# EAGLE design IE ARSA Merah W (EAGLE 8.5.1)
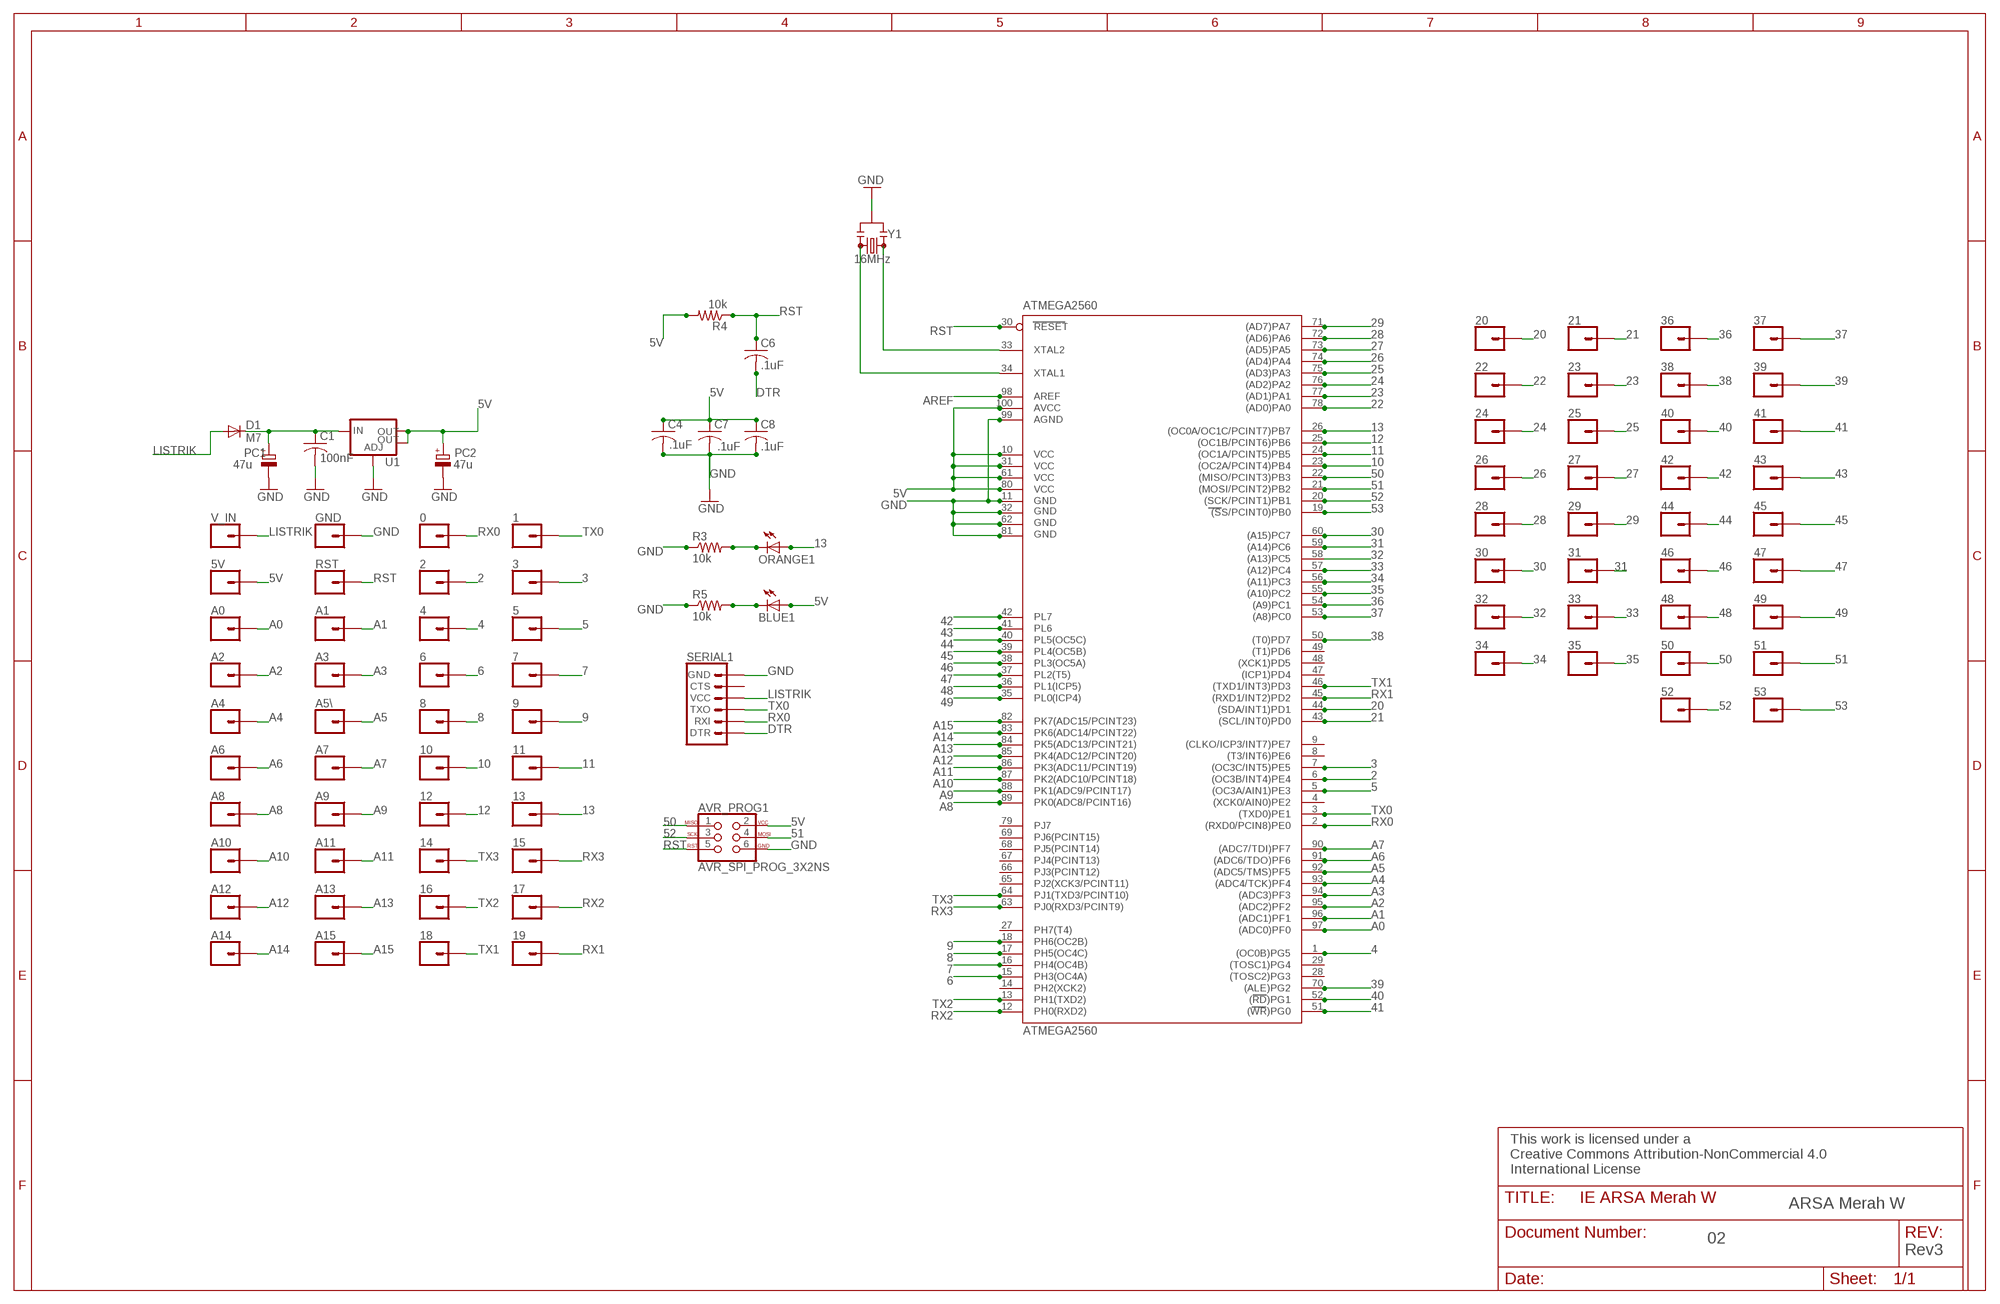
[diagram p0: schematic, sheet 1]

## Parts
0  CONN_01  [1X01]
1  CONN_01  [1X01]
2  CONN_01  [1X01]
3  CONN_01  [1X01]
4  CONN_01  [1X01]
5  CONN_01  [1X01]
5V  CONN_01  [1X01]
6  CONN_01  [1X01]
7  CONN_01  [1X01]
8  CONN_01  [1X01]
9  CONN_01  [1X01]
10  CONN_01  [1X01]
11  CONN_01  [1X01]
12  CONN_01  [1X01]
13  CONN_01  [1X01]
14  CONN_01  [1X01]
15  CONN_01  [1X01]
16  CONN_01  [1X01]
17  CONN_01  [1X01]
18  CONN_01  [1X01]
19  CONN_01  [1X01]
20  CONN_01  [1X01]
21  CONN_01  [1X01]
22  CONN_01  [1X01]
23  CONN_01  [1X01]
24  CONN_01  [1X01]
25  CONN_01  [1X01]
26  CONN_01  [1X01]
27  CONN_01  [1X01]
28  CONN_01  [1X01]
29  CONN_01  [1X01]
30  CONN_01  [1X01]
31  CONN_01  [1X01]
32  CONN_01  [1X01]
33  CONN_01  [1X01]
34  CONN_01  [1X01]
35  CONN_01  [1X01]
36  CONN_01  [1X01]
37  CONN_01  [1X01]
38  CONN_01  [1X01]
39  CONN_01  [1X01]
40  CONN_01  [1X01]
41  CONN_01  [1X01]
42  CONN_01  [1X01]
43  CONN_01  [1X01]
44  CONN_01  [1X01]
45  CONN_01  [1X01]
46  CONN_01  [1X01]
47  CONN_01  [1X01]
48  CONN_01  [1X01]
49  CONN_01  [1X01]
50  CONN_01  [1X01]
51  CONN_01  [1X01]
52  CONN_01  [1X01]
53  CONN_01  [1X01]
A0  CONN_01  [1X01]
A1  CONN_01  [1X01]
A2  CONN_01  [1X01]
A3  CONN_01  [1X01]
A4  CONN_01  [1X01]
A5\  CONN_01  [1X01]
A6  CONN_01  [1X01]
A7  CONN_01  [1X01]
A8  CONN_01  [1X01]
A9  CONN_01  [1X01]
A10  CONN_01  [1X01]
A11  CONN_01  [1X01]
A12  CONN_01  [1X01]
A13  CONN_01  [1X01]
A14  CONN_01  [1X01]
A15  CONN_01  [1X01]
ATMEGA2560  ATMEGA2560  [TQFP100]
AVR_PROG1  AVR_SPI_PROG_3X2NS  [2X3-NS]
BLUE1  L  LED-SMD-0805  [SMD-0805-LED]
C1  100nF  CAPACITOR-SMD-0805  [SMD-0805]
C4  CAPACITOR-SMD-0805  [SMD-0805]
C6  .1uF  CAPACITOR-SMD-0805  [SMD-0805]
C7  .1uF  CAPACITOR-SMD-0805  [SMD-0805]
C8  .1uF  CAPACITOR-SMD-0805  [SMD-0805]
D1  M7  DIODE-SMB  [SMB]
GND  CONN_01  [1X01]
ORANGE1  L  LED-SMD-0805  [SMD-0805-LED]
PC1  47u  CPOL-EUD  [PANASONIC_D]
PC2  47u  CPOL-EUD  [PANASONIC_D]
R3  10k  RESISTOR-SMD-0805  [SMD-0805]
R4  10k  RESISTOR-SMD-0805  [SMD-0805]
R5  10k  RESISTOR-SMD-0805  [SMD-0805]
RST  CONN_01  [1X01]
SERIAL1  6_PIN_SERIAL_TARGET  [1X06]
U1  V_REG_LM1117SOT223  [SOT223]
V_IN  CONN_01  [1X01]
Y1  16MHz  RESONATOR-16MHZSMD_3.2X1.3  [RESONATOR-SMD-3.2X1.3]

## Nets
2: 2.1 ATMEGA2560.6((OC3B/INT4)PE4)
3: 3.1 ATMEGA2560.7((OC3C/INT5)PE5)
4: 4.1 ATMEGA2560.1((OC0B)PG5)
5: 5.1 ATMEGA2560.5((OC3A/AIN1)PE3)
5V: 5V.1 ATMEGA2560.10(VCC) ATMEGA2560.31(VCC1) ATMEGA2560.61(VCC2) ATMEGA2560.80(VCC3) ATMEGA2560.100(AVCC) AVR_PROG1.2 BLUE1.1(A) C4.1 C7.1 C8.1 PC2.+ R4.2 U1.2(OUT) U1.4(OUT)
6: 6.1 ATMEGA2560.15(PH3(OC4A))
7: 7.1 ATMEGA2560.16(PH4(OC4B))
8: 8.1 ATMEGA2560.17(PH5(OC4C))
9: 9.1 ATMEGA2560.18(PH6(OC2B))
10: 10.1 ATMEGA2560.23((OC2A/PCINT4)PB4)
11: 11.1 ATMEGA2560.24((OC1A/PCINT5)PB5)
12: 12.1 ATMEGA2560.25((OC1B/PCINT6)PB6)
13: 13.1 ATMEGA2560.26((OC0A/OC1C/PCINT7)PB7) ORANGE1.1(A)
20: 20.1 ATMEGA2560.44((SDA/INT1)PD1)
21: 21.1 ATMEGA2560.43((SCL/INT0)PD0)
22: 22.1 ATMEGA2560.78((AD0)PA0)
23: 23.1 ATMEGA2560.77((AD1)PA1)
24: 24.1 ATMEGA2560.76((AD2)PA2)
25: 25.1 ATMEGA2560.75((AD3)PA3)
26: 26.1 ATMEGA2560.74((AD4)PA4)
27: 27.1 ATMEGA2560.73((AD5)PA5)
28: 28.1 ATMEGA2560.72((AD6)PA6)
29: 29.1 ATMEGA2560.71((AD7)PA7)
30: 30.1 ATMEGA2560.60((A15)PC7)
31: 31.1 ATMEGA2560.59((A14)PC6)
32: 32.1 ATMEGA2560.58((A13)PC5)
33: 33.1 ATMEGA2560.57((A12)PC4)
34: 34.1 ATMEGA2560.56((A11)PC3)
35: 35.1 ATMEGA2560.55((A10)PC2)
36: 36.1 ATMEGA2560.54((A9)PC1)
37: 37.1 ATMEGA2560.53((A8)PC0)
38: 38.1 ATMEGA2560.50((T0)PD7)
39: 39.1 ATMEGA2560.70((ALE)PG2)
40: 40.1 ATMEGA2560.52((RD)PG1)
41: 41.1 ATMEGA2560.51((WR)PG0)
42: 42.1 ATMEGA2560.42(PL7)
43: 43.1 ATMEGA2560.41(PL6)
44: 44.1 ATMEGA2560.40(PL5(OC5C))
45: 45.1 ATMEGA2560.39(PL4(OC5B))
46: 46.1 ATMEGA2560.38(PL3(OC5A))
47: 47.1 ATMEGA2560.37(PL2(T5))
48: 48.1 ATMEGA2560.36(PL1(ICP5))
49: 49.1 ATMEGA2560.35(PL0(ICP4))
50: 50.1 ATMEGA2560.22((MISO/PCINT3)PB3) AVR_PROG1.1
51: 51.1 ATMEGA2560.21((MOSI/PCINT2)PB2) AVR_PROG1.4
52: 52.1 ATMEGA2560.20((SCK/PCINT1)PB1) AVR_PROG1.3
53: 53.1 ATMEGA2560.19((SS/PCINT0)PB0)
A0: A0.1 ATMEGA2560.97((ADC0)PF0)
A1: A1.1 ATMEGA2560.96((ADC1)PF1)
A2: A2.1 ATMEGA2560.95((ADC2)PF2)
A3: A3.1 ATMEGA2560.94((ADC3)PF3)
A4: A4.1 ATMEGA2560.93((ADC4/TCK)PF4)
A5: A5\.1 ATMEGA2560.92((ADC5/TMS)PF5)
A6: A6.1 ATMEGA2560.91((ADC6/TDO)PF6)
A7: A7.1 ATMEGA2560.90((ADC7/TDI)PF7)
A8: A8.1 ATMEGA2560.89(PK0(ADC8/PCINT16))
A9: A9.1 ATMEGA2560.88(PK1(ADC9/PCINT17))
A10: A10.1 ATMEGA2560.87(PK2(ADC10/PCINT18))
A11: A11.1 ATMEGA2560.86(PK3(ADC11/PCINT19))
A12: A12.1 ATMEGA2560.85(PK4(ADC12/PCINT20))
A13: A13.1 ATMEGA2560.84(PK5(ADC13/PCINT21))
A14: A14.1 ATMEGA2560.83(PK6(ADC14/PCINT22))
A15: A15.1 ATMEGA2560.82(PK7(ADC15/PCINT23))
AREF: ATMEGA2560.98(AREF)
DTR: C6.2 SERIAL1.1(DTR)
GND: ATMEGA2560.11(GND) ATMEGA2560.32(GND1) ATMEGA2560.62(GND2) ATMEGA2560.81(GND3) ATMEGA2560.99(AGND) AVR_PROG1.6 C1.2 C4.2 C7.2 C8.2 GND.1 PC1.- PC2.- R3.1 R5.1 SERIAL1.6(GND) U1.1(ADJ) Y1.2
LISTRIK: D1.A SERIAL1.4(VCC) V_IN.1
N$1: ORANGE1.2(C) R3.2
N$2: ATMEGA2560.33(XTAL2) Y1.1
N$3: BLUE1.2(C) R5.2
N$4: ATMEGA2560.34(XTAL1) Y1.3
RST: ATMEGA2560.30(RESET) AVR_PROG1.5 C6.1 R4.1 RST.1
RX0: 0.1 ATMEGA2560.2((RXD0/PCIN8)PE0) SERIAL1.2(RXI)
RX1: 19.1 ATMEGA2560.45((RXD1/INT2)PD2)
RX2: 17.1 ATMEGA2560.12(PH0(RXD2))
RX3: 15.1 ATMEGA2560.63(PJ0(RXD3/PCINT9))
TX0: 1.1 ATMEGA2560.3((TXD0)PE1) SERIAL1.3(TXO)
TX1: 18.1 ATMEGA2560.46((TXD1/INT3)PD3)
TX2: 16.1 ATMEGA2560.13(PH1(TXD2))
TX3: 14.1 ATMEGA2560.64(PJ1(TXD3/PCINT10))
VIN: C1.1 D1.C PC1.+ U1.3(IN)
Unconnected: ATMEGA2560.4((XCK0/AIN0)PE2) ATMEGA2560.8((T3/INT6)PE6) ATMEGA2560.9((CLKO/ICP3/INT7)PE7) ATMEGA2560.14(PH2(XCK2)) ATMEGA2560.27(PH7(T4)) ATMEGA2560.28((TOSC2)PG3) ATMEGA2560.29((TOSC1)PG4) ATMEGA2560.47((ICP1)PD4) ATMEGA2560.48((XCK1)PD5) ATMEGA2560.49((T1)PD6) ATMEGA2560.65(PJ2(XCK3/PCINT11)) ATMEGA2560.66(PJ3(PCINT12)) ATMEGA2560.67(PJ4(PCINT13)) ATMEGA2560.68(PJ5(PCINT14)) ATMEGA2560.69(PJ6(PCINT15)) ATMEGA2560.79(PJ7) SERIAL1.5(CTS)

## Notes on the sheet
- .1uF
- This work is licensed under a 
  Creative Commons Attribution-NonCommercial 4.0
  International License
- ARSA Merah W
- 02
- Rev3

## Library data of the parts
0 1-5 5V 6-53 A0 A1-A4 A5\ A6-A15 GND RST V_IN = SparkFun-Connectors:CONN_01: Single connection point. Often used as Generic Header-pin footprint for 0.1 inch spaced/style header connections On any of the 0.1 inch spaced packages, you can populate with these: Break Away Headers - Straight <https://www.sparkfun.com/products/116> (PRT-00116) Break Away Male Headers - Right Angle <https://www.sparkfun.com/products/553> (PRT-00553) Female Headers <https://www.sparkfun.com/products/115> (PRT-00115) Break Away Headers - Machine Pin <https://www.sparkfun.com/products/117> (PRT-00117) Break Away Female Headers - Swiss Machine Pin <https://www.sparkfun.com/products/743> (PRT-00743) This device is also useful as a general connection point to wire up your design to another part of your project. Our various solder wires solder well into these plated through hole pads. Hook-Up Wire - Assortment (Stranded, 22 AWG) <https://www.sparkfun.com/products/11375> (PRT-11375) Hook-Up Wire - Assortment (Solid Core, 22 AWG) <https://www.sparkfun.com/products/11367> (PRT-11367) View the entire wire category on our website here <https://www.sparkfun.com/categories/141> Special notes: SMTSO-256-ET is a "flush mount" nut for a 4-40 screw. We mostly use this on specialty testbeds; it is a nice way to connect hardware to your PCB at an adjustable hieght. Also note, the SNAP packages are for using a snappable style connector. We sell a baggie of snaps and they are also used on two LilyPad designs: Snap Assortment - 30 pack (male and female) <https://www.sparkfun.com/products/11347> (DEV-11347) LilyPad Arduino SimpleSnap <https://www.sparkfun.com/products/10941> (DEV-10941) LilyPad SimpleSnap Protoboard <https://www.sparkfun.com/products/10940> (DEV-10940)
ATMEGA2560 = Fuzzy:ATMEGA2560
AVR_PROG1 = SparkFun-Connectors:AVR_SPI_PROG_3X2: AVR ISP 6 Pin This is the reduced ISP connector for AVR programming. Common on Arduino. This footprint will take up less PCB space and can be used with a 10-pin to 6-pin adapter such as SKU: BOB-08508 **Special note about "TEST_POINT" package. The stop mask is on the top side, so if you want your programming test points to be on the bottom of your board, make sure to place this package on the bottom side of the board. This also ensure that the orientation to program from the bottom side will be correct. SparkFun Products: SparkFun ISP Pogo Adapter <https://www.sparkfun.com/products/11591> - NS Tiny AVR Programmer <https://www.sparkfun.com/products/11801> -PTH
BLUE1 ORANGE1 = Fuzzy:LED-SMD-0805
C1 C4 C6-C8 = Fuzzy:CAPACITOR-SMD-0805
D1 = diode:DIODE-: DIODE
PC1 PC2 = rcl:CPOL-EU: POLARIZED CAPACITOR, European symbol
R3-R5 = Fuzzy:RESISTOR-SMD-0805
SERIAL1 = SparkFun-Connectors:6_PIN_SERIAL_TARGET: 6-pin header connection for use with the "FTDI BASIC" pinout - TARGET SIDE. Also known as "Arduino Serial Program Header". It is used to mate with our FTDI Basic serial programmers using the Arduino IDE. Note, this device has "TARGET" in the name. It is intended to be used on a design that contains a target micro-controller that you wish to program. The "sister" device, named "CABLE" is inteneded to be used on a design that usually lives on the end of your USB cable and prvides the converter chip (FTDI232 or FTDI231x) to commnicate serial RX/TX. You can populate with some of these: Break Away Headers - Straight <https://www.sparkfun.com/products/116> (PRT-00116) For reference (or to suit your programming needs) check out these designs: SparkFun FTDI Basic Breakout - 5V <https://www.sparkfun.com/products/9716> (DEV-09716) SparkFun FTDI Basic Breakout - 3.3V <https://www.sparkfun.com/products/9873> (DEV-09873) SparkFun FTDI SmartBasic <https://www.sparkfun.com/products/12935> (DEV-12935) SparkFun Beefy 3 - FTDI Basic Breakout <https://www.sparkfun.com/products/13746> (DEV-13746)
U1 = SparkFun-IC-Power:V_REG_LM1117: Voltage Regulator LM1117 Standard adjustable voltage regulator but in SMD form. Spark Fun Electronics SKU : COM-00595; PROD_ID: VREG-08170
Y1 = SparkFun-Clocks:RESONATOR-16MHZ: 16MHz Resonator Digikey Example <http://www.digikey.com/product-detail/en/murata-electronics-north-america/CSTCE16M0V53-R0/490-1198-1-ND/584635> Frequency: 16MHz Frequency Stability: ±0.3% Frequency Tolerance: ±0.5% Capacitance: 15pF SparkFun Products SparkFun OpenLog <https://www.sparkfun.com/products/13712> SparkFun MicroView - OLED Arduino Module <https://www.sparkfun.com/products/12923>; PROD_ID: XTAL-08900

## Net classes
0 default: width 0.15 mm, drill 0.3 mm, clearance 0.15 mm

## Board
ARSA Merah W
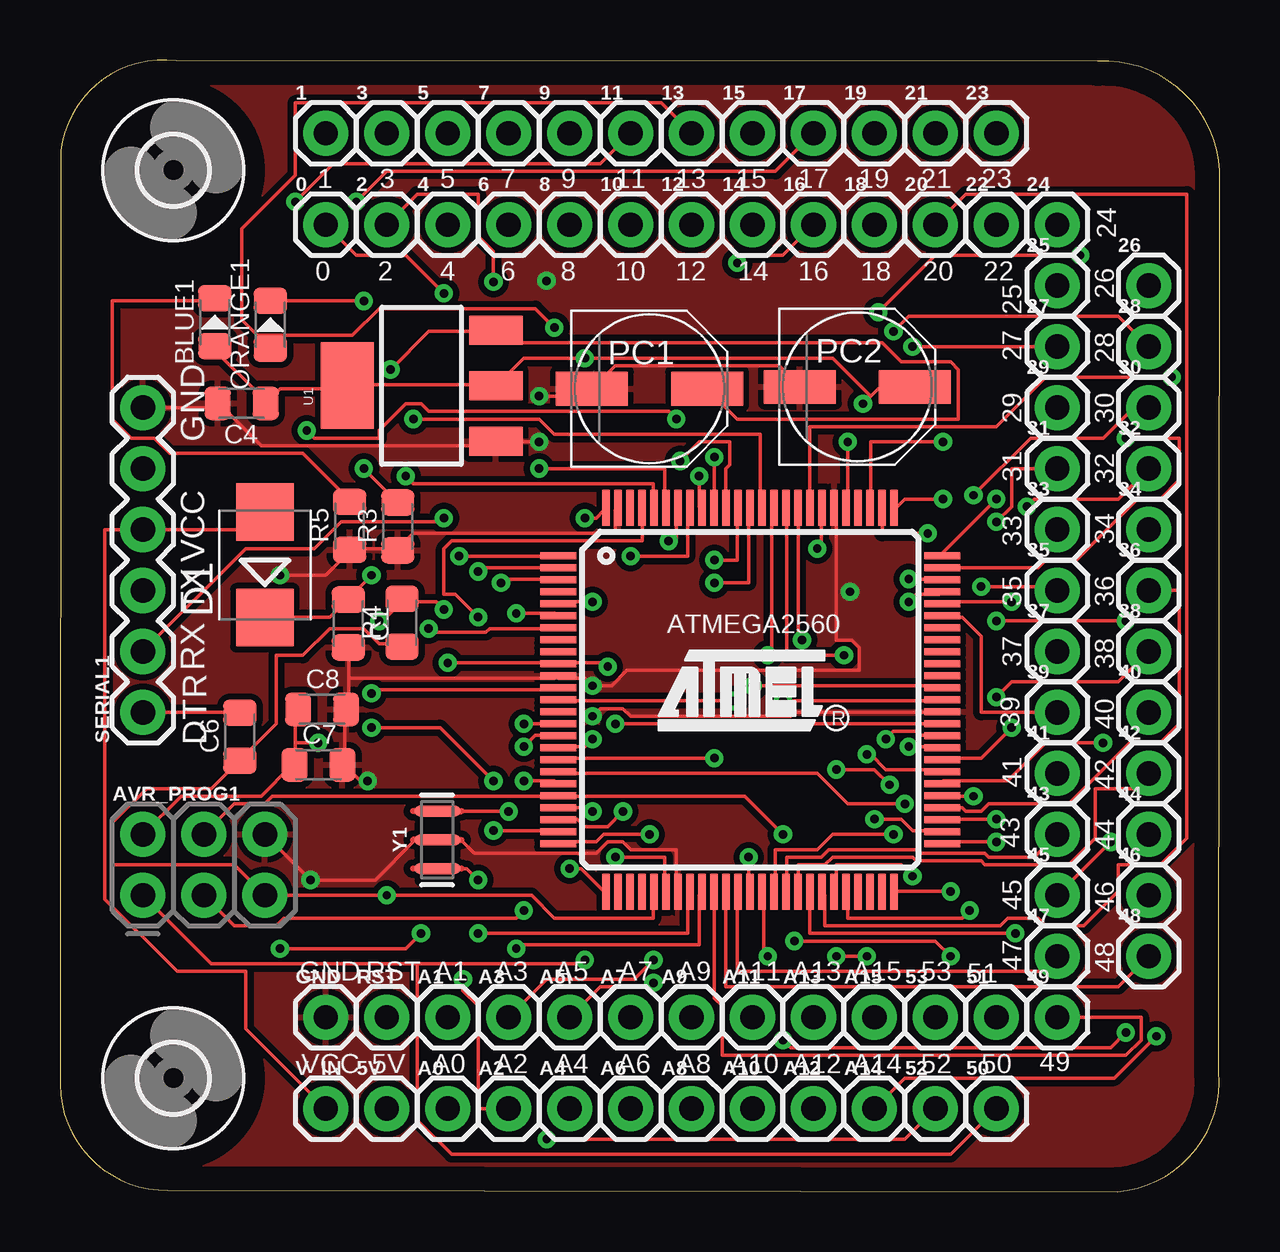
[diagram p1: board, top side]
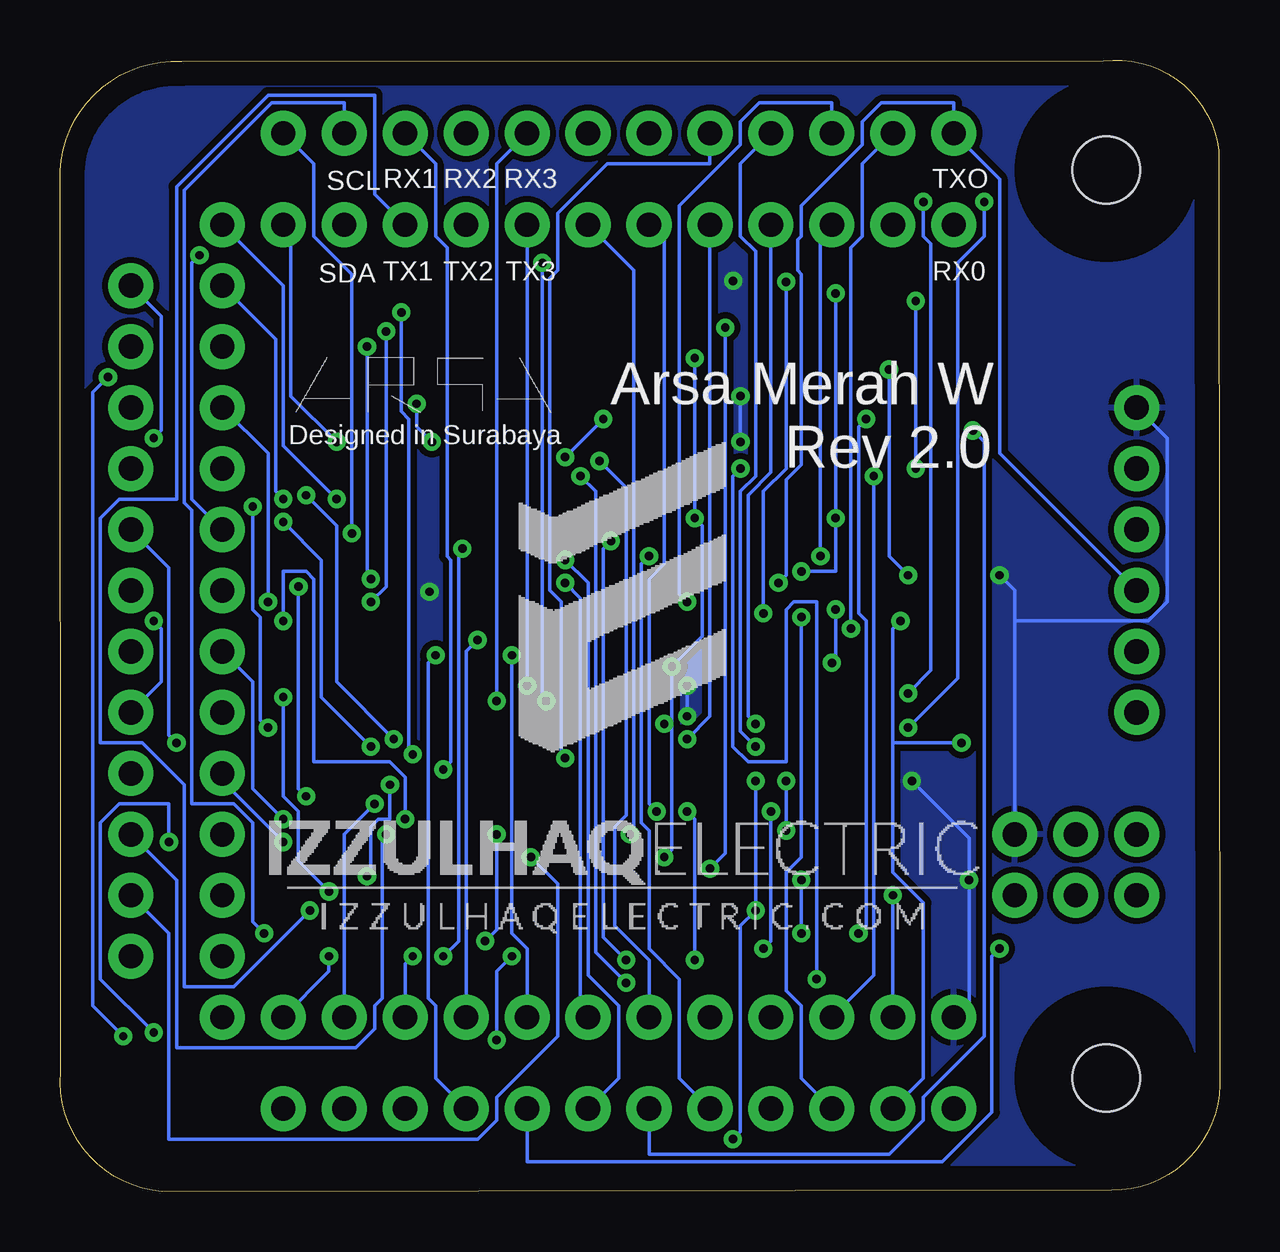
[diagram p2: board, bottom side, seen from below]

Size 48.32 x 47.15 mm. Coordinates in mm from the lower left corner, seen from the top.
Outline: 43.25,47.09 4.84,47.12 arc90 0.03,43.36 0,4.45 arc90 4.5,0.05 44.05,0 arc90 48.29,4.97 48.32,42.53 arc90 43.25,47.09
Copper layers ((1*16)): Top 0.04mm / dielectric 0.5mm / Bottom 0.04mm
Design rules "default *": minimum track width 6mil, minimum drill 0.35mm, track to track 6mil, track to pad 6mil, pad to pad 6mil, via to via 6mil, smd to smd 6mil, copper to edge 40mil, drill to drill 6mil, minimum pad ring 10mil, minimum via ring 8mil, stop-mask expansion 4mil, vias tented up to drill 0mil, thermal gap 10mil

### Footprints (pad centres in the part's own frame; a part is rotated, then mirrored left to right if it is on the bottom)
1X01 = drill 1.016 pad 1.88: 1 0,0
TQFP100 = smd 1.5 x 0.3: 1 -8,6; 2 -8,5.5; 3 -8,5; 4 -8,4.5; 5 -8,4; 6 -8,3.5; 7 -8,3; 8 -8,2.5; 9 -8,2; 10 -8,1.5; 11 -8,1; 12 -8,0.5; 13 -8,0; 14 -8,-0.5; 15 -8,-1; 16 -8,-1.5; 17 -8,-2; 18 -8,-2.5; 19 -8,-3; 20 -8,-3.5; 21 -8,-4; 22 -8,-4.5; 23 -8,-5; 24 -8,-5.5; 25 -8,-6; 51 8,-6; 52 8,-5.5; 53 8,-5; 54 8,-4.5; 55 8,-4; 56 8,-3.5; 57 8,-3; 58 8,-2.5; 59 8,-2; 60 8,-1.5; 61 8,-1; 62 8,-0.5; 63 8,0; 64 8,0.5; 65 8,1; 66 8,1.5; 67 8,2; 68 8,2.5; 69 8,3; 70 8,3.5; 71 8,4; 72 8,4.5; 73 8,5; 74 8,5.5; 75 8,6 | smd 0.3 x 1.5: 26 -6,-8; 27 -5.5,-8; 28 -5,-8; 29 -4.5,-8; 30 -4,-8; 31 -3.5,-8; 32 -3,-8; 33 -2.5,-8; 34 -2,-8; 35 -1.5,-8; 36 -1,-8; 37 -0.5,-8; 38 0,-8; 39 0.5,-8; 40 1,-8; 41 1.5,-8; 42 2,-8; 43 2.5,-8; 44 3,-8; 45 3.5,-8; 46 4,-8; 47 4.5,-8; 48 5,-8; 49 5.5,-8; 50 6,-8; 76 6,8; 77 5.5,8; 78 5,8; 79 4.5,8; 80 4,8; 81 3.5,8; 82 3,8; 83 2.5,8; 84 2,8; 85 1.5,8; 86 1,8; 87 0.5,8; 88 0,8; 89 -0.5,8; 90 -1,8; 91 -1.5,8; 92 -2,8; 93 -2.5,8; 94 -3,8; 95 -3.5,8; 96 -4,8; 97 -4.5,8; 98 -5,8; 99 -5.5,8; 100 -6,8
2X3-NS = drill 1.016 pad 1.88: 1 -2.54,-1.27; 2 -2.54,1.27; 3 0,-1.27; 4 0,1.27; 5 2.54,-1.27; 6 2.54,1.27
SMD-0805-LED = smd 1.1 x 1.4: 1 -1,0; 2 1,0
SMD-0805 = smd 1.1 x 1.4: 1 -1,0; 2 1,0
SMB = smd 2.4 x 2.4: A 2.2,0; C -2.2,0
PANASONIC_D = smd 3 x 1.4: + 2.4,0; - -2.4,0
1X06 = drill 1.016 pad 1.88: 1 0,0; 2 2.54,0; 3 5.08,0; 4 7.62,0; 5 10.16,0; 6 12.7,0
SOT223 = smd 1.219 x 2.235: 1 -2.311,-3.099; 2 0,-3.099; 3 2.311,-3.099 | smd 3.6 x 2.2: 4 0,3.099
2,8 = hole 2.8: 0,0
RESONATOR-SMD-3.2X1.3 = smd 0.45 x 1.905: 1 -1.2,0; 2 0,0; 3 1.2,0

### Placement (x,y rotation side)
0  11.07,40.28 0 top
1  11.07,44.09 0 top
2  13.61,40.28 0 top
3  13.61,44.09 0 top
4  16.15,40.28 0 top
5  16.15,44.09 0 top
5V  13.61,3.45 0 top
6  18.69,40.28 0 top
7  18.69,44.09 0 top
8  21.23,40.28 0 top
9  21.23,44.09 0 top
10  23.77,40.28 0 top
11  23.77,44.09 0 top
12  26.31,40.28 0 top
13  26.31,44.09 0 top
14  28.85,40.28 0 top
15  28.85,44.09 0 top
16  31.39,40.28 0 top
17  31.39,44.09 0 top
18  33.93,40.28 0 top
19  33.93,44.09 0 top
20  36.47,40.28 0 top
21  36.47,44.09 0 top
22  39.01,40.28 0 top
23  39.01,44.09 0 top
24  41.55,40.28 0 top
25  41.55,37.74 0 top
26  45.36,37.74 0 top
27  41.55,35.2 0 top
28  45.36,35.2 0 top
29  41.55,32.66 0 top
30  45.36,32.66 0 top
31  41.55,30.12 0 top
32  45.36,30.12 0 top
33  41.55,27.58 0 top
34  45.36,27.58 0 top
35  41.55,25.04 0 top
36  45.36,25.04 0 top
37  41.55,22.5 0 top
38  45.36,22.5 0 top
39  41.55,19.96 0 top
40  45.36,19.96 0 top
41  41.55,17.42 0 top
42  45.36,17.42 0 top
43  41.55,14.88 0 top
44  45.36,14.88 0 top
45  41.55,12.34 0 top
46  45.36,12.34 0 top
47  41.55,9.8 0 top
48  45.36,9.8 0 top
49  41.55,7.26 0 top
50  39.01,3.45 0 top
51  39.01,7.26 0 top
52  36.47,3.45 0 top
53  36.47,7.26 0 top
A0  16.15,3.45 0 top
A1  16.15,7.26 0 top
A2  18.69,3.45 0 top
A3  18.69,7.26 0 top
A4  21.23,3.45 0 top
A5\  21.23,7.26 0 top
A6  23.77,3.45 0 top
A7  23.77,7.26 0 top
A8  26.31,3.45 0 top
A9  26.31,7.26 0 top
A10  28.85,3.45 0 top
A11  28.85,7.26 0 top
A12  31.39,3.45 0 top
A13  31.39,7.26 0 top
A14  33.93,3.45 0 top
A15  33.93,7.26 0 top
ATMEGA2560  28.75,20.5 0 top
AVR_PROG1  5.99,13.61 0 top
BLUE1  6.45,36.22 90 top
C1  12.01,23.67 270 top
C4  7.57,32.84 180 top
C6  7.49,18.95 90 top
C7  10.77,17.78 0 top
C8  10.92,20.09 0 top
D1  8.53,26.11 90 top
GND  11.07,7.26 0 top
ORANGE1  8.76,36.12 90 top
PC1  24.56,33.45 0 top
PC2  33.22,33.53 0 top
R3  14.07,27.71 90 top
R4  14.25,23.7 90 top
R5  12.07,27.74 90 top
RST  13.61,7.26 0 top
SERIAL1  3.45,19.96 90 top
U1  15.06,33.58 90 top
U$1  [2,8]  4.72,42.56 0 top
U$2  [2,8]  4.72,4.72 0 top
V_IN  11.07,3.45 0 top
Y1  15.72,14.66 90 top

### Tracks (layer width: path | path; a pad name or v marks a point on that pad's centre or on a via)
2  (via drill 0.35)
  Top 0.152: v19.01,24.09 20.6,24.09 ATMEGA2560.6 | v18.06,37.9 18.06,39.17 17.42,39.81 17.42,41.55 14.88,41.55 2.1
  Bottom 0.152: v19.01,24.09 19.01,29.17 18.06,30.12 v18.06,37.9
3  (via drill 0.35)
  Top 0.152: v15.36,23.46 15.52,23.3 17.74,23.3 17.9,23.46 20.6,23.46 ATMEGA2560.7
  Bottom 0.152: v15.36,23.46 15.36,39.33 14.88,39.81 14.88,42.82 3.1
4  (via drill 0.35)
  Top 0.152: v16.63,26.47 20.6,26.47 ATMEGA2560.1
  Bottom 0.152: v16.63,26.47 16.63,39.81 4.1
5  (via drill 0.35)
  Top 0.152: v22.19,24.57 20.76,24.57 ATMEGA2560.5
  Bottom 0.152: v22.19,24.57 22.5,24.89 22.5,41.08 19.96,43.62 19.96,44.57 19.17,45.36 16.15,45.36 5.1
5V  (via drill 0.35)
  Top 0.152: v32.82,31.24 32.82,28.54 ATMEGA2560.80 | 33.78,33.14 34.09,33.46 35.52,33.46 PC2.+ | 33.78,33.14 v33.46,32.82 | BLUE1.1 6.31,35.2 8.53,32.98 C4.1 8.69,32.98 9.17,33.46 11.87,33.46 U1.4 12.03,33.62 18.06,33.62 U1.2 18.22,33.62 19.33,34.73 v21.87,34.73 32.19,34.73 33.78,33.14 | 9.8,18.69 9.8,19.96 C8.1 | 9.8,18.69 9.8,17.9 C7.1 9.65,17.74 8.38,16.47 5.04,16.47 AVR_PROG1.2 | 14.25,24.57 13.46,23.77 v13.3,23.77 | v16.15,22.03 20.6,22.03 ATMEGA2560.10 20.76,22.03 22.66,22.03 v22.82,21.87 | v16,24.25 15.68,24.57 14.25,24.57 | 14.25,24.57 R4.2 | v23.14,13.93 25.2,13.93 25.2,12.5 ATMEGA2560.31 | v23.14,19.49 36.63,19.49 ATMEGA2560.61 | v21.87,28.06 22.35,28.06 22.66,28.38 ATMEGA2560.100 | v10.76,18.69 9.8,18.69
  Bottom 0.152: v32.82,31.24 33.46,31.87 v33.46,32.82 | v13.3,23.77 13.61,23.46 13.61,18.69 | 13.61,18.69 13.61,13.3 12.34,12.03 12.34,4.72 5V.1 | v16.15,22.03 16,22.19 v16,24.25 | v23.14,13.93 22.82,14.25 22.82,19.49 | 22.82,19.49 v22.82,21.87 21.55,23.14 21.55,27.74 v21.87,28.06 v21.87,34.73 | 22.82,19.49 v23.14,19.49 | 13.61,18.69 v10.76,18.69
6  (via drill 0.35)
  Top 0.152: v19.33,19.49 20.6,19.49 ATMEGA2560.15
  Bottom 0.152: v19.33,19.49 19.65,19.81 19.65,29.01 18.69,29.97 6.1
7  (via drill 0.35)
  Top 0.152: v19.33,18.54 19.81,19.01 20.6,19.01 ATMEGA2560.16
  Bottom 0.152: v19.33,18.54 19.96,19.17 19.96,29.17 19.33,29.81 19.33,39.17 19.96,39.81 19.96,42.82 7.1
8  (via drill 0.35)
  Top 0.152: v22.19,18.85 21.87,18.54 20.76,18.54 ATMEGA2560.17
  Bottom 0.152: v22.19,18.85 21.23,19.81 8.1
9  (via drill 0.35)
  Top 0.152: v27.27,18.06 20.76,18.06 ATMEGA2560.18
  Bottom 0.152: v27.27,18.06 27.43,18.22 27.43,24.57 27.9,25.04 27.9,38.06 27.58,38.38 27.58,40.76 25.52,42.82 21.23,42.82 9.1
10  (via drill 0.35)
  Top 0.152: v23.46,15.84 22.82,15.2 21.87,15.2 21.55,15.52 20.76,15.52 ATMEGA2560.23
  Bottom 0.152: v23.46,15.84 23.77,16.15 23.77,25.52 23.14,26.16 23.14,39.65 10.1
11  (via drill 0.35)
  Top 0.152: v18.06,15.04 20.6,15.04 ATMEGA2560.24 | v18.06,17.11 15.84,19.33 v12.98,19.33 | v9.8,41.24 11.39,42.82 22.5,42.82 11.1
  Bottom 0.152: v18.06,17.11 v18.06,15.04 | v12.98,19.33 10.92,21.39 10.92,38.7 9.8,39.81 v9.8,41.24
12  (via drill 0.35)
  Top 0.152: v24.57,14.88 22.66,14.88 22.35,14.57 20.76,14.57 ATMEGA2560.25
  Bottom 0.152: v24.57,14.88 24.41,15.04 24.41,38.38 12.1
13  (via drill 0.35)
  Top 0.152: 8.22,35.68 7.58,36.32 7.58,40.13 9.8,42.35 9.8,45.36 25.04,45.36 13.1 | 8.22,35.68 8.69,35.2 ORANGE1.1 | v21.23,13.46 21.71,13.46 22.66,12.5 ATMEGA2560.26 | v20.6,36 19.81,36.79 13.3,36.79 12.19,35.68 8.22,35.68
  Bottom 0.152: v21.23,13.46 20.6,14.09 v20.6,36
20
  Top 0.152: 20.1 37.74,41.55 46.95,41.55 46.95,14.73 45.84,13.61 44.09,13.61 44.09,12.5 42.67,11.07 41.08,11.07 40.76,11.39 39.49,11.39 39.17,11.07 31.87,11.07 31.87,12.34 ATMEGA2560.44
21  (via drill 0.35)
  Top 0.152: v39.81,10.76 31.24,10.76 31.24,12.34 ATMEGA2560.43
  Bottom 0.152: v39.81,10.76 40.28,11.23 40.28,15.36 41.08,16.15 42.82,16.15 42.82,28.38 43.14,28.7 43.14,41.71 39.49,45.36 36.47,45.36 21.1
22  (via drill 0.35)
  Top 0.152: v36.79,31.24 33.78,31.24 33.78,28.54 ATMEGA2560.78
  Bottom 0.152: v36.79,31.24 38.7,33.14 38.7,39.97 22.1
23  (via drill 0.35)
  Top 0.152: v36.16,27.43 34.25,27.43 34.25,28.38 ATMEGA2560.77
  Bottom 0.152: v36.16,27.43 36.16,38.22 37.74,39.81 37.74,42.82 23.1
24  (via drill 0.35)
  Top 0.152: v36.79,28.85 35.2,28.85 34.89,28.54 ATMEGA2560.76
  Bottom 0.152: v36.79,28.85 39.01,31.08 39.01,37.74 24.1
25  (via drill 0.35)
  Top 0.152: v39.01,28.85 36.79,26.63 ATMEGA2560.75
  Bottom 0.152: v39.01,28.85 39.33,29.17 39.33,35.52 25.1
26  (via drill 0.35)
  Top 0.152: v44.41,31.39 46.63,31.39 46.63,29.65 45.84,28.85 44.89,28.85 42.35,26.31 41.08,26.31 40.76,26 36.79,26 ATMEGA2560.74
  Bottom 0.152: v44.41,31.39 44.09,31.71 44.09,36.47 26.1
27  (via drill 0.35)
  Top 0.152: v35.36,25.52 36.63,25.52 ATMEGA2560.73 | 27.1 v35.52,35.2
  Bottom 0.152: v35.36,25.52 35.52,25.68 v35.52,35.2
28  (via drill 0.35)
  Top 0.152: v35.36,24.57 35.68,24.89 36.63,24.89 ATMEGA2560.72 | v34.73,35.84 35.36,36.47 44.09,36.47 28.1
  Bottom 0.152: v35.36,24.57 34.73,25.2 v34.73,35.84
29  (via drill 0.35)
  Top 0.152: v39.65,24.57 36.79,24.57 ATMEGA2560.71
  Bottom 0.152: v39.65,24.57 39.65,30.76 29.1
30  (via drill 0.35)
  Top 0.152: v34.41,18.85 34.73,19.17 35.68,19.17 35.84,19.01 36.63,19.01 ATMEGA2560.60 | v38.06,29.01 40.44,31.39 43.46,31.39 44.73,32.66 30.1
  Bottom 0.152: v34.41,18.85 36.79,21.23 36.79,27.74 v38.06,29.01
31  (via drill 0.35)
  Top 0.152: v35.36,18.54 36.63,18.54 ATMEGA2560.59 | v39.01,27.9 39.65,28.54 39.65,30.12 31.1
  Bottom 0.152: v35.36,18.54 37.43,20.6 37.43,26.31 v39.01,27.9
32  (via drill 0.35)
  Top 0.152: v39.65,19.33 38.38,18.06 36.79,18.06 ATMEGA2560.58 | v40.28,28.54 40.6,28.85 44.09,28.85 32.1
  Bottom 0.152: v39.65,19.33 39.97,19.65 39.97,23.93 40.28,24.25 v40.28,28.54
33  (via drill 0.35)
  Top 0.152: v33.62,18.22 33.78,18.22 34.41,17.58 36.63,17.58 ATMEGA2560.57 | v34.09,36.63 36.47,39.01 v42.51,39.01
  Bottom 0.152: v33.62,18.22 33.78,18.38 33.78,32.19 34.09,32.51 v34.09,36.63 | v42.51,39.01 42.82,38.7 42.82,28.85 33.1
34  (via drill 0.35)
  Top 0.152: v43.46,18.69 41.08,18.69 39.49,17.11 36.79,17.11 ATMEGA2560.56
  Bottom 0.152: v43.46,18.69 43.78,19.01 43.78,26 34.1
35  (via drill 0.35)
  Top 0.152: v38.06,16.47 36.79,16.47 ATMEGA2560.55 | v38.38,25.2 41.4,25.2 35.1
  Bottom 0.152: v38.06,16.47 38.38,16.79 v38.38,25.2
36
  Top 0.152: 36.1 46.63,25.04 46.63,19.49 45.84,18.69 44.57,18.69 42.03,16.15 38.7,16.15 38.38,15.84 37.74,15.84 37.59,16 36.79,16 ATMEGA2560.54
37  (via drill 0.35)
  Top 0.152: v39.01,15.52 36.79,15.52 ATMEGA2560.53
  Bottom 0.152: v39.01,15.52 40.28,16.79 40.28,21.23 37.1
38  (via drill 0.35)
  Top 0.152: v37.11,12.5 34.89,12.5 ATMEGA2560.50 | v39.01,20.6 39.65,21.23 44.09,21.23 38.1
  Bottom 0.152: v37.11,12.5 38.38,13.77 38.38,15.84 39.01,16.47 v39.01,20.6
39
  Top 0.152: 39.1 38.38,19.96 38.38,23.14 37.59,23.93 36.79,23.93 ATMEGA2560.70
40  (via drill 0.35)
  Top 0.152: v33.93,15.52 35.05,15.52 35.52,15.04 36.63,15.04 ATMEGA2560.52 | v44.41,23.77 v39.01,23.77
  Bottom 0.152: v33.93,15.52 33.93,17.27 34.57,17.9 37.74,17.9 37.74,25.52 38.06,25.84 39.01,25.84 v39.01,23.77 | v44.41,23.77 44.09,23.46 44.09,21.23 40.1
41  (via drill 0.35)
  Top 0.152: v39.01,14.57 36.79,14.57 ATMEGA2560.51
  Bottom 0.152: v39.01,14.57 41.55,17.11 41.1
42
  Top 0.152: 42.1 44.73,16.79 43.14,16.79 43.14,14.73 42.03,13.61 38.54,13.61 38.38,13.77 35.68,13.77 35.52,13.93 32.19,13.93 31.87,13.61 30.76,13.61 ATMEGA2560.42
43
  Top 0.152: 43.1 40.6,13.93 38.7,13.93 38.54,14.09 35.84,14.09 35.68,14.25 32.03,14.25 31.71,13.93 30.28,13.93 30.28,12.5 ATMEGA2560.41
44  (via drill 0.35)
  Top 0.152: v34.73,14.88 32.19,14.88 31.55,14.25 29.81,14.25 29.81,12.5 ATMEGA2560.40
  Bottom 0.152: v34.73,14.88 34.89,14.73 34.89,8.06 35.2,7.74 35.2,6.79 36,5.99 43.46,5.99 43.46,12.98 44.1
45  (via drill 0.35)
  Top 0.152: v29.49,9.8 29.33,9.8 29.33,12.34 ATMEGA2560.39 | v30.12,6.31 30.44,5.99 43.78,5.99 v44.41,6.63 | 45.1 v43.78,14.57
  Bottom 0.152: v29.49,9.8 30.12,9.17 v30.12,6.31 | v44.41,6.63 46.63,8.85 46.63,15.36 45.84,16.15 43.78,16.15 v43.78,14.57
46  (via drill 0.35)
  Top 0.152: v28.7,13.93 28.7,12.5 ATMEGA2560.38
  Bottom 0.152: v28.7,13.93 27.58,12.82 27.58,6.47 30.12,3.93 30.12,2.98 30.92,2.18 43.78,2.18 43.78,10.76 46.1
47
  Top 0.152: 47.1 40.92,9.17 28.22,9.17 28.22,12.34 ATMEGA2560.37
48
  Top 0.152: 48.1 44.09,8.53 27.74,8.53 27.74,12.34 ATMEGA2560.36
49
  Top 0.152: 49.1 45.05,7.26 45.05,6.31 44.41,5.68 27.58,5.68 27.58,7.74 27.27,8.06 27.27,12.34 ATMEGA2560.35
50  (via drill 0.35)
  Top 0.152: v22.19,15.84 22.03,16 ATMEGA2560.22 | v21.87,9.65 21.71,9.49 14.88,9.49 | 14.88,9.49 6.31,9.49 AVR_PROG1.1 | 50.1 37.11,1.55 16.31,1.55 14.88,2.98 14.88,9.49
  Bottom 0.152: v22.19,15.84 21.87,15.52 v21.87,9.65
51  (via drill 0.35)
  Top 0.152: AVR_PROG1.4 7.26,16.15 8.53,16.15 8.85,16.47 20.6,16.47 ATMEGA2560.21 20.76,16.47 28.54,16.47 v30.12,14.88 | v37.11,9.8 36.47,10.44 v30.6,10.44
  Bottom 0.152: 51.1 37.11,9.17 v37.11,9.8 | v30.6,10.44 30.12,10.92 v30.12,14.88
52  (via drill 0.35)
  Top 0.152: v19.33,17.11 20.6,17.11 ATMEGA2560.20 | v19.33,11.71 19.01,11.39 9.33,11.39 9.01,11.07 7.26,11.07 AVR_PROG1.3 | 52.1 35.2,2.18 v20.28,2.18
  Bottom 0.152: v19.33,17.11 v19.33,11.71 19.96,11.07 19.96,2.5 v20.28,2.18
53  (via drill 0.35)
  Top 0.152: v35.2,16.15 32.82,16.15 31.55,17.42 20.76,17.42 ATMEGA2560.19
  Bottom 0.152: v35.2,16.15 36.47,14.88 53.1
A0  (via drill 0.35)
  Top 0.152: v17.42,23.93 16.47,24.89 16,24.89 16,26.79 16.31,27.11 24.25,27.11 24.25,28.38 ATMEGA2560.97
  Bottom 0.152: v17.42,23.93 17.42,13.93 18.06,13.3 18.06,8.38 17.42,7.74 17.42,4.72 A0.1
A1  (via drill 0.35)
  Top 0.152: v14.41,29.81 14.73,29.49 24.73,29.49 24.73,28.54 ATMEGA2560.96
  Bottom 0.152: v14.41,29.81 14.41,9.01 A1.1
A2  (via drill 0.35)
  Top 0.152: v19.96,30.12 25.2,30.12 25.2,28.54 ATMEGA2560.95 | v16.79,8.85 16.79,8.38 17.42,7.74 17.42,3.45 A2.1
  Bottom 0.152: v19.96,30.12 20.28,29.81 20.28,18.54 19.65,17.9 18.06,17.9 18.06,24.25 17.74,24.57 16.79,24.57 v16.79,8.85
A3  (via drill 0.35)
  Top 0.152: v25.36,27.11 25.68,27.11 25.68,28.38 ATMEGA2560.94 | v24.73,9.65 23.93,8.85 20.28,8.85 A3.1
  Bottom 0.152: v25.36,27.11 25.68,26.79 25.68,10.6 v24.73,9.65
A4  (via drill 0.35)
  Top 0.152: v23.77,26.47 26.16,26.47 26.16,28.38 ATMEGA2560.93
  Bottom 0.152: v23.77,26.47 24.09,26.16 24.09,15.36 23.77,15.04 23.77,10.12 22.5,8.85 22.5,4.72 A4.1
A5  (via drill 0.35)
  Top 0.152: v26.63,29.81 26.63,28.54 ATMEGA2560.92 | v24.73,8.69 24.57,8.53 22.5,8.53 A5\.1
  Bottom 0.152: v26.63,29.81 26,29.17 26,9.96 v24.73,8.69
A6  (via drill 0.35)
  Top 0.152: v27.27,30.6 27.27,28.54 ATMEGA2560.91 | v25.68,32.19 25.36,32.51 15.36,32.51 15.04,32.82 14.41,32.82 13.3,31.71 13.3,31.39 10.6,31.39 v10.28,31.71
  Bottom 0.152: v25.68,32.19 v27.27,30.6 | v10.28,31.71 9.8,31.24 9.8,6.47 12.34,3.93 12.34,2.98 13.77,1.55 23.77,1.55 A6.1
A7  (via drill 0.35)
  Top 0.152: v25.84,30.44 26.63,31.24 27.9,31.24 27.9,30.28 27.74,30.12 27.74,28.54 ATMEGA2560.90
  Bottom 0.152: v25.84,30.44 24.73,29.33 24.73,15.68 25.2,15.2 25.2,11.07 23.77,9.65 A7.1
A8  (via drill 0.35)
  Top 0.152: v27.27,26.31 28.22,26.31 28.22,28.38 ATMEGA2560.89
  Bottom 0.152: v27.27,26.31 26.31,25.36 26.31,9.01 25.04,7.74 25.04,4.72 A8.1
A9  (via drill 0.35)
  Top 0.152: v27.27,25.36 28.7,25.36 28.7,28.38 ATMEGA2560.88
  Bottom 0.152: v27.27,25.36 26.63,24.73 26.63,7.58 A9.1
A10  (via drill 0.35)
  Top 0.152: v14.73,32.19 19.96,32.19 20.6,31.55 29.17,31.55 29.17,28.54 ATMEGA2560.87 | v15.04,10.76 14.41,10.12 v9.17,10.12
  Bottom 0.152: v14.73,32.19 15.04,31.87 15.04,24.09 14.73,23.77 14.73,11.07 v15.04,10.76 | v9.17,10.12 9.49,9.8 9.49,3.3 11.55,1.23 28.85,1.23 A10.1
A11  (via drill 0.35)
  Top 0.152: v29.49,22.35 29.65,22.35 29.65,28.38 ATMEGA2560.86
  Bottom 0.152: v29.49,22.35 29.49,10.76 28.85,10.12 A11.1
A12  (via drill 0.35)
  Top 0.152: v32.66,22.35 30.28,22.35 30.28,28.38 ATMEGA2560.85
  Bottom 0.152: v32.66,22.35 32.98,22.03 32.98,8.06 32.66,7.74 32.66,4.72 A12.1
A13  (via drill 0.35)
  Top 0.152: v30.92,22.98 30.76,22.98 30.76,28.38 ATMEGA2560.84
  Bottom 0.152: v30.92,22.98 31.39,22.5 A13.1
A14  (via drill 0.35)
  Top 0.152: v46.32,33.93 41.08,33.93 39.01,31.87 31.24,31.87 31.24,28.54 ATMEGA2560.83 | v45.68,6.47 43.94,4.72 35.2,4.72 A14.1
  Bottom 0.152: v46.32,33.93 46.95,33.3 46.95,7.74 v45.68,6.47
A15  (via drill 0.35)
  Top 0.152: v31.55,26.79 31.71,26.79 31.71,28.38 ATMEGA2560.82 | v33.62,9.8 v32.35,9.8
  Bottom 0.152: v31.55,26.79 31.71,26.63 31.71,10.44 v32.35,9.8 | v33.62,9.8 33.93,9.49 A15.1
DTR
  Top 0.152: SERIAL1.1 7.42,19.96 C6.2
GND  (via drill 0.35)
  Top 0.152: 12.03,21.39 12.03,20.12 C8.2 11.87,19.96 11.87,17.9 C7.2 11.87,17.74 12.5,17.11 v12.82,17.11 | 12.03,21.39 12.03,22.66 C1.2 | 12.03,21.39 20.6,21.39 ATMEGA2560.11 20.76,21.39 21.87,21.39 v22.19,21.08 22.98,21.08 23.62,21.71 33.3,21.71 33.3,22.66 32.98,22.98 32.35,22.98 32.35,28.38 ATMEGA2560.81 | v22.19,19.81 22.5,20.12 23.46,20.12 23.77,19.81 30.44,19.81 30.6,19.96 36.63,19.96 ATMEGA2560.62 | PC2.- 30.76,33.62 29.97,34.41 23.14,34.41 22.19,33.46 PC1.- 22.03,33.3 21.87,33.14 v19.96,33.14 | SERIAL1.6 6.31,32.66 6.47,32.82 C4.2 6.63,32.82 8.38,31.08 17.9,31.08 18.06,31.24 U1.1 18.22,31.24 v19.96,31.24 | ATMEGA2560.99 23.14,28.38 23.14,27.43 14.73,27.43 14.09,26.79 R3.1 13.93,26.79 12.19,26.79 R5.1 12.03,26.63 11.07,25.68 v9.17,25.68 | ATMEGA2560.32 25.68,12.5 25.68,14.25 23.77,14.25 23.46,14.57 22.82,14.57 22.35,14.09 17.27,14.09 16.79,14.57 Y1.2 | AVR_PROG1.6 v10.44,12.98 13.14,12.98 14.73,14.57 14.71,14.66
  Bottom 0.152: v22.19,21.08 v22.19,19.81 | v19.96,31.24 v19.96,33.14 | GND.1 10.44,7.9 v10.44,12.98 10.44,14.73 v12.82,17.11 | v9.17,25.68 8.53,25.04 8.53,23.77 | AVR_PROG1.6 8.53,23.77 | SERIAL1.6 2.18,31.39 2.18,24.57 2.98,23.77 8.53,23.77
  other vias: 32.92,24.99 20.27,37.95
  pour Bottom (isolate 0.254): 0,41.3 0,4.42 arc90 4.42,0 43.59,0 arc90 48.31,4.72 48.31,42.37 arc90 43.59,47.09 4.11,47.09 arc90 0,42.98
  pour Top (isolate 0.254): 0,41.3 0,4.42 arc90 4.42,0 43.59,0 arc90 48.31,4.72 48.31,42.37 arc90 43.59,47.09 4.11,47.09 arc90 0,42.98
LISTRIK
  Top 0.152: D1.A 8.53,28.22 7.9,27.58 SERIAL1.4 1.87,27.58 1.87,12.19 4.88,9.17 7.74,9.17 7.74,6.79 V_IN.1
N$1  (via drill 0.35)
  Top 0.152: v12.66,30.12 13.93,28.85 R3.2 | v12.66,37.11 8.85,37.11 ORANGE1.2
  Bottom 0.152: v12.66,37.11 v12.66,30.12
N$2  (via drill 0.35)
  Top 0.152: v17.42,10.76 26.16,10.76 26.16,12.34 ATMEGA2560.33 | v17.42,12.98 16.95,13.46 16.79,13.46 Y1.1
  Bottom 0.152: v17.42,12.98 v17.42,10.76
N$3
  Top 0.152: R5.2 12.03,28.85 10.12,30.76 4.57,30.76 3.93,31.39 2.98,31.39 2.18,32.19 2.18,37.11 6.31,37.11 BLUE1.2
N$4  (via drill 0.35)
  Top 0.152: v19.01,10.12 19.17,10.28 26.63,10.28 26.63,12.34 ATMEGA2560.34 | v18.69,15.84 16.79,15.84 Y1.3
  Bottom 0.152: v19.01,10.12 18.69,10.44 v18.69,15.84
RST  (via drill 0.35)
  Top 0.152: R4.1 14.25,22.82 13.3,22.82 12.66,23.46 11.23,23.46 10.12,22.35 9.01,22.35 9.01,19.49 7.58,18.06 C6.1 7.42,17.9 6.31,16.79 3.61,16.79 2.18,15.36 2.18,13.61 7.26,13.61 AVR_PROG1.5 v13.61,12.34 19.65,12.34 20.6,11.39 24.73,11.39 24.73,12.34 ATMEGA2560.30
  Bottom 0.152: v13.61,12.34 RST.1
RX0  (via drill 0.35)
  Top 0.152: v17.42,25.84 17.58,26 20.6,26 ATMEGA2560.2 | v16,37.43 14.41,39.01 12.34,39.01 0.1 | SERIAL1.2 7.74,26.79 10.6,26.79 11.71,27.9 15.84,27.9 v16,28.06
  Bottom 0.152: v17.42,25.84 16,25.84 v16,28.06 v16,37.43
RX1  (via drill 0.35)
  Top 0.152: v35.52,13.14 35.05,13.61 32.35,13.61 32.35,12.5 ATMEGA2560.45 | v34.57,16.95 33.93,17.58 v32.35,17.58
  Bottom 0.152: v35.52,13.14 35.36,13.3 35.36,15.2 35.05,15.52 34.57,15.52 v34.57,16.95 | v32.35,17.58 32.03,17.9 32.03,26.31 32.19,26.47 32.19,39.33 32.66,39.81 32.66,42.82 19.1
RX2  (via drill 0.35)
  Top 0.152: v12.98,20.76 13.14,20.92 20.6,20.92 ATMEGA2560.12 | v12.34,41.24 13.61,42.51 29.81,42.51 17.1
  Bottom 0.152: v12.98,20.76 12.03,21.71 12.03,39.49 12.34,39.81 v12.34,41.24
RX3  (via drill 0.35)
  Top 0.152: v30.12,20.44 36.63,20.44 ATMEGA2560.63
  Bottom 0.152: v30.12,20.44 30.12,42.82 15.1
TX0  (via drill 0.35)
  Top 0.152: v18.38,25.36 18.54,25.52 20.6,25.52 ATMEGA2560.3
  Bottom 0.152: v18.38,25.36 18.06,25.68 18.06,29.65 17.42,30.28 17.42,38.22 17.58,38.38 17.58,39.65 17.42,39.81 17.42,41.08 14.88,43.62 14.88,44.57 14.09,45.36 11.07,45.36 1.1 9.17,42.19 9.17,30.76 SERIAL1.3
TX1  (via drill 0.35)
  Top 0.152: v37.9,11.71 37.59,11.39 32.82,11.39 32.82,12.34 ATMEGA2560.46
  Bottom 0.152: v37.9,11.71 41.08,8.53 43.14,8.53 43.14,16.95 44.89,18.69 46.63,18.69 46.63,28.06 45.84,28.85 43.46,28.85 43.46,41.87 39.65,45.68 35.2,45.68 35.2,41.55 18.1
TX2  (via drill 0.35)
  Top 0.152: v28.06,20.44 20.76,20.44 ATMEGA2560.13 | v28.22,38.7 28.54,39.01 30.12,39.01 16.1
  Bottom 0.152: v28.06,20.44 28.22,20.6 v28.22,38.7
TX3  (via drill 0.35)
  Top 0.152: v28.85,21.08 36.63,21.08 ATMEGA2560.64
  Bottom 0.152: 14.1 v28.85,21.08
VIN  (via drill 0.35)
  Top 0.152: D1.C 8.53,23.93 11.23,23.93 11.87,24.57 C1.1 12.03,24.73 v12.98,25.68 | PC1.+ 27.11,33.3 28.22,32.19 37.43,32.19 37.43,34.25 37.11,34.57 35.05,34.57 34.25,35.36 18.69,35.36 18.22,35.84 U1.3 18.06,35.84 15.36,35.84 v13.77,34.25
  Bottom 0.152: v12.98,25.68 13.77,26.47 v13.77,34.25

### Text on the board
tPlace: 1 | 3 | 5 | 7 | 9 | 11 | 13 | 15 | 17 | 19 | 21 | 23 | 24 | 0 | 2 | 4 | 6 | 8 | 10 | 12 | 14 | 16 | 18 | 20 | 22 | 25 | 26 | 27 | 28 | 29 | 30 | GND | 31 | 32 | 33 | 34 | VCC | TX | 35 | 36 | RX | 37 | 38 | DTR | 39 | 40 | 41 | 42 | 43 | 44 | 45 | 46 | GND | RST | A1 | A3 | A5 | A7 | A9 | A11 | A13 | A15 | 53 | 51 | 47 | 48 | VCC | 5V | A0 | A2 | A4 | A6 | A8 | A10 | A12 | A14 | 52 | 50 | 49
bPlace: TXO | RX3 | RX2 | RX1 | SCL | RX0 | TX3 | TX2 | TX1 | SDA | Arsa Merah W | Designed in Surabaya | Rev 2.0